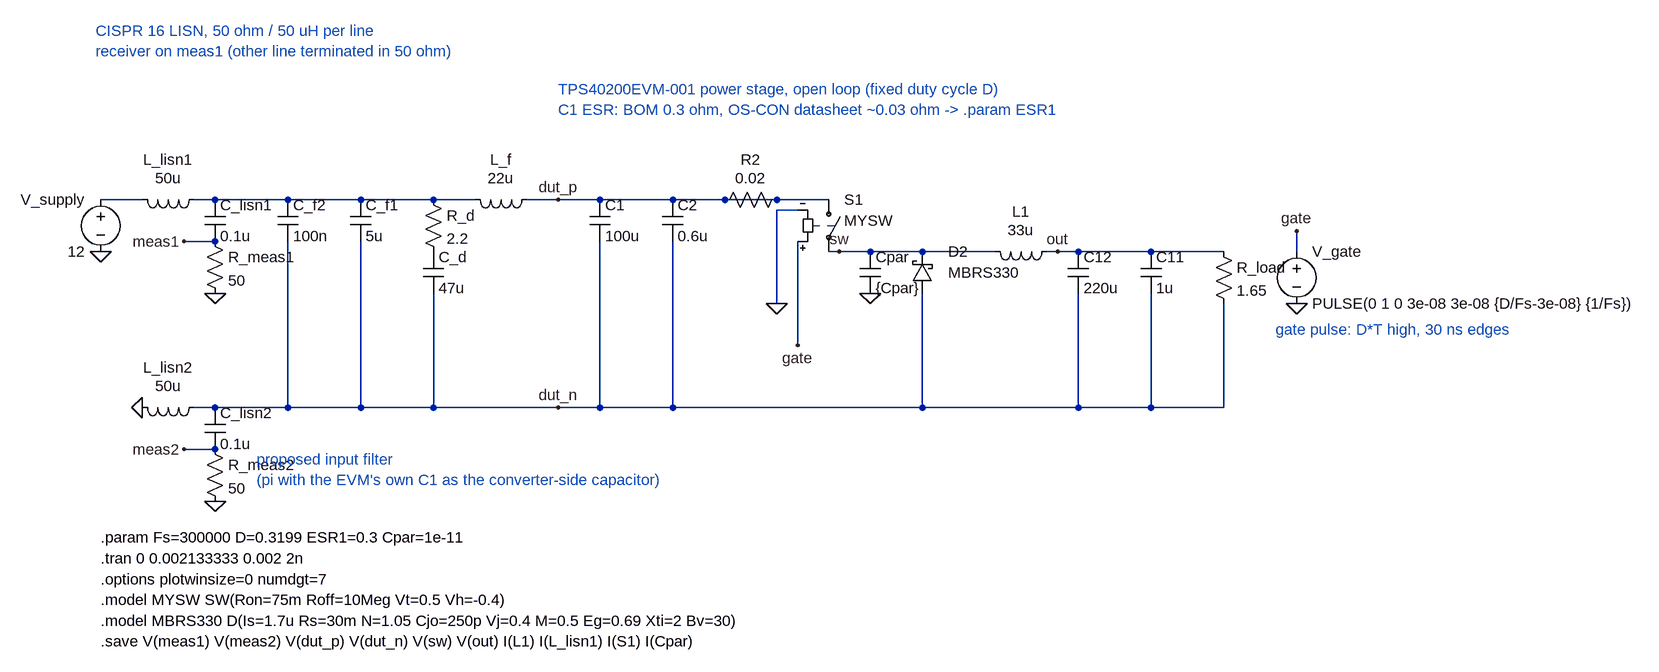
[diagram p0: schematic Buck_LISN_withFilter.asc]
Buck_LISN_withFilter.asc, the LTspice schematic file:
Version 4
SHEET 1 2200 1000
SYMBOL voltage 0 -16 R0
WINDOW 0 -24 16 Right 2
WINDOW 3 -24 96 Right 2
SYMATTR InstName V_supply
SYMATTR Value 12
FLAG 0 80 0
WIRE 0 0 64 0
SYMBOL ind 160 -16 R90
WINDOW 0 -30 56 VBottom 2
WINDOW 3 -2 56 VBottom 2
SYMATTR InstName L_lisn1
SYMATTR Value 50u
SYMATTR SpiceLine Rser=10m
WIRE 144 0 240 0
SYMBOL cap 160 0 R0
SYMATTR InstName C_lisn1
SYMATTR Value 0.1u
WIRE 176 64 128 64
FLAG 128 64 meas1
SYMBOL res 160 48 R0
SYMATTR InstName R_meas1
SYMATTR Value 50
FLAG 176 144 0
FLAG 64 320 0
SYMBOL ind 160 304 R90
WINDOW 0 -30 56 VBottom 2
WINDOW 3 -2 56 VBottom 2
SYMATTR InstName L_lisn2
SYMATTR Value 50u
SYMATTR SpiceLine Rser=10m
WIRE 144 320 240 320
SYMBOL cap 160 320 R0
SYMATTR InstName C_lisn2
SYMATTR Value 0.1u
WIRE 176 384 128 384
FLAG 128 384 meas2
SYMBOL res 160 368 R0
SYMATTR InstName R_meas2
SYMATTR Value 50
FLAG 176 464 0
TEXT -8 -260 Left 2 ;CISPR 16 LISN, 50 ohm / 50 uH per line\nreceiver on meas1 (other line terminated in 50 ohm)
WIRE 240 0 576 0
WIRE 240 320 704 320
SYMBOL cap 272 0 R0
SYMATTR InstName C_f2
SYMATTR Value 100n
SYMATTR SpiceLine Rser=20m Lser=0.5n
WIRE 288 64 288 320
SYMBOL cap 384 0 R0
SYMATTR InstName C_f1
SYMATTR Value 5u
SYMATTR SpiceLine Rser=5m Lser=1n
WIRE 400 64 400 320
SYMBOL res 496 -16 R0
SYMATTR InstName R_d
SYMATTR Value 2.2
SYMBOL cap 496 80 R0
SYMATTR InstName C_d
SYMATTR Value 47u
SYMATTR SpiceLine Rser=0.5
WIRE 512 144 512 320
SYMBOL ind 672 -16 R90
WINDOW 0 -30 56 VBottom 2
WINDOW 3 -2 56 VBottom 2
SYMATTR InstName L_f
SYMATTR Value 22u
SYMATTR SpiceLine Rser=100m Cpar=5p Rpar=5k
WIRE 656 0 704 0
TEXT 240 400 Left 2 ;proposed input filter\n(pi with the EVM's own C1 as the converter-side capacitor)
WIRE 704 0 1040 0
WIRE 704 320 1536 320
FLAG 704 0 dut_p
FLAG 704 320 dut_n
SYMBOL cap 752 0 R0
SYMATTR InstName C1
SYMATTR Value 100u
SYMATTR SpiceLine Rser={ESR1} Lser=5n
WIRE 768 64 768 320
SYMBOL cap 864 0 R0
SYMATTR InstName C2
SYMATTR Value 0.6u
SYMATTR SpiceLine Rser=10m Lser=0.6n
WIRE 880 64 880 320
SYMBOL res 1056 -16 R90
WINDOW 0 -30 56 VBottom 2
WINDOW 3 -2 56 VBottom 2
SYMATTR InstName R2
SYMATTR Value 0.02
SYMBOL sw 1120 -16 R0
WINDOW 0 24 16 Left 2
WINDOW 3 24 48 Left 2
SYMATTR InstName S1
SYMATTR Value MYSW
WIRE 1040 0 1120 0
WIRE 1072 64 1072 224
FLAG 1072 224 gate
WIRE 1072 16 1040 16
WIRE 1040 16 1040 160
FLAG 1040 160 0
WIRE 1120 80 1376 80
FLAG 1136 80 sw
SYMBOL cap 1168 80 R0
SYMATTR InstName Cpar
SYMATTR Value {Cpar}
FLAG 1184 144 0
SYMBOL schottky 1280 144 R180
WINDOW 0 -24 64 Right 2
WINDOW 3 -24 32 Right 2
SYMATTR InstName D2
SYMATTR Value MBRS330
WIRE 1264 144 1264 320
SYMBOL ind 1472 64 R90
WINDOW 0 -30 56 VBottom 2
WINDOW 3 -2 56 VBottom 2
SYMATTR InstName L1
SYMATTR Value 33u
SYMATTR SpiceLine Rser=39m
WIRE 1456 80 1616 80
FLAG 1472 80 out
SYMBOL cap 1488 80 R0
SYMATTR InstName C12
SYMATTR Value 220u
SYMATTR SpiceLine Rser=0.4 Lser=5n
WIRE 1504 144 1504 320
SYMBOL cap 1600 80 R0
SYMATTR InstName C11
SYMATTR Value 1u
SYMATTR SpiceLine Rser=10m Lser=0.6n
WIRE 1616 144 1616 320
WIRE 1616 80 1728 80
WIRE 1536 320 1728 320
SYMBOL res 1712 64 R0
SYMATTR InstName R_load
SYMATTR Value 1.65
WIRE 1728 160 1728 320
SYMBOL voltage 1840 64 R0
SYMATTR InstName V_gate
SYMATTR Value PULSE(0 1 0 3e-08 3e-08 {D/Fs-3e-08} {1/Fs})
WIRE 1840 80 1840 48
FLAG 1840 48 gate
FLAG 1840 160 0
TEXT 704 -170 Left 2 ;TPS40200EVM-001 power stage, open loop (fixed duty cycle D)\nC1 ESR: BOM 0.3 ohm, OS-CON datasheet ~0.03 ohm -> .param ESR1
TEXT 1808 200 Left 2 ;gate pulse: D*T high, 30 ns edges
TEXT 0 520 Left 2 !.param Fs=300000 D=0.3199 ESR1=0.3 Cpar=1e-11
TEXT 0 552 Left 2 !.tran 0 0.002133333 0.002 2n
TEXT 0 584 Left 2 !.options plotwinsize=0 numdgt=7
TEXT 0 616 Left 2 !.model MYSW SW(Ron=75m Roff=10Meg Vt=0.5 Vh=-0.4)
TEXT 0 648 Left 2 !.model MBRS330 D(Is=1.7u Rs=30m N=1.05 Cjo=250p Vj=0.4 M=0.5 Eg=0.69 Xti=2 Bv=30)
TEXT 0 680 Left 2 !.save V(meas1) V(meas2) V(dut_p) V(dut_n) V(sw) V(out) I(L1) I(L_lisn1) I(S1) I(Cpar)

The netlist it stands for:
* Buck_LISN_withFilter.asc
V_supply N001 0 12
L_lisn1 N002 N001 50u Rser=10m
C_lisn1 N002 meas1 0.1u
R_meas1 meas1 0 50
L_lisn2 dut_n 0 50u Rser=10m
C_lisn2 dut_n meas2 0.1u
R_meas2 meas2 0 50
C_f2 N002 dut_n 100n Rser=20m Lser=0.5n
C_f1 N002 dut_n 5u Rser=5m Lser=1n
R_d N002 P001 2.2
C_d P001 dut_n 47u Rser=0.5
L_f dut_p N002 22u Rser=100m Cpar=5p Rpar=5k
C1 dut_p dut_n 100u Rser={ESR1} Lser=5n
C2 dut_p dut_n 0.6u Rser=10m Lser=0.6n
R2 dut_p dut_p 0.02
S1 dut_p sw gate 0 MYSW
Cpar sw 0 {Cpar}
D2 dut_n sw MBRS330
L1 out sw 33u Rser=39m
C12 out dut_n 220u Rser=0.4 Lser=5n
C11 out dut_n 1u Rser=10m Lser=0.6n
R_load out dut_n 1.65
V_gate gate 0 PULSE(0 1 0 3e-08 3e-08 {D/Fs-3e-08} {1/Fs})
.model D D
.lib standard.dio
* CISPR 16 LISN, 50 ohm / 50 uH per line
* receiver on meas1 (other line terminated in 50 ohm)
* proposed input filter
* (pi with the EVM's own C1 as the converter-side capacitor)
* TPS40200EVM-001 power stage, open loop (fixed duty cycle D)
* C1 ESR: BOM 0.3 ohm, OS-CON datasheet ~0.03 ohm -> .param ESR1
* gate pulse: D*T high, 30 ns edges
.param Fs=300000 D=0.3199 ESR1=0.3 Cpar=1e-11
.tran 0 0.002133333 0.002 2n
.options plotwinsize=0 numdgt=7
.model MYSW SW(Ron=75m Roff=10Meg Vt=0.5 Vh=-0.4)
.model MBRS330 D(Is=1.7u Rs=30m N=1.05 Cjo=250p Vj=0.4 M=0.5 Eg=0.69 Xti=2 Bv=30)
.save V(meas1) V(meas2) V(dut_p) V(dut_n) V(sw) V(out) I(L1) I(L_lisn1) I(S1) I(Cpar)
.backanno
.end